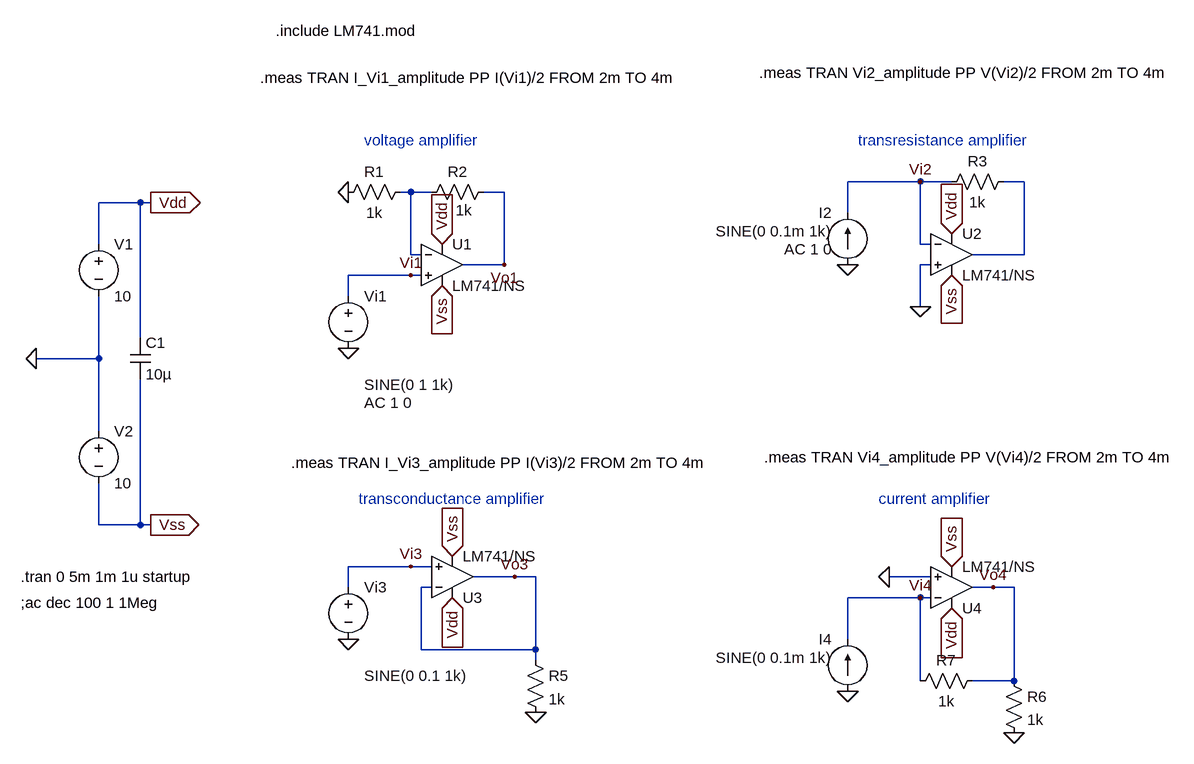
[diagram p0: schematic amplifiers_input_impedances.asc]
amplifiers_input_impedances.asc, the LTspice schematic file:
Version 4
SHEET 1 1220 680
WIRE 768 -384 656 -384
WIRE 816 -384 768 -384
WIRE 928 -384 896 -384
WIRE -16 -368 -32 -368
WIRE 16 -368 -16 -368
WIRE 128 -368 96 -368
WIRE -432 -352 -496 -352
WIRE -416 -352 -432 -352
WIRE 656 -336 656 -384
WIRE -496 -288 -496 -352
WIRE 768 -288 768 -384
WIRE 784 -288 768 -288
WIRE -16 -272 -16 -368
WIRE 0 -272 -16 -272
WIRE 928 -272 928 -384
WIRE 928 -272 848 -272
WIRE 128 -256 128 -368
WIRE 128 -256 64 -256
WIRE 784 -256 768 -256
WIRE -16 -240 -112 -240
WIRE 0 -240 -16 -240
WIRE -112 -208 -112 -240
WIRE 768 -192 768 -256
WIRE -432 -144 -432 -352
WIRE -496 -112 -496 -208
WIRE -496 -112 -592 -112
WIRE -496 0 -496 -112
WIRE -496 144 -496 80
WIRE -432 144 -432 -80
WIRE -432 144 -496 144
WIRE -416 144 -432 144
WIRE -16 208 -112 208
WIRE 16 208 -16 208
WIRE 144 224 80 224
WIRE 176 224 144 224
WIRE 784 224 720 224
WIRE -112 240 -112 208
WIRE 16 240 0 240
WIRE 880 240 848 240
WIRE 912 240 880 240
WIRE 768 256 656 256
WIRE 784 256 768 256
WIRE 656 320 656 256
WIRE 0 336 0 240
WIRE 176 336 176 224
WIRE 176 336 0 336
WIRE 176 352 176 336
WIRE 768 384 768 256
WIRE 912 384 912 240
WIRE 912 384 848 384
FLAG -416 -352 Vdd
IOPIN -416 -352 Out
FLAG -416 144 Vss
IOPIN -416 144 Out
FLAG -592 -112 0
FLAG 32 -288 Vdd
IOPIN 32 -288 In
FLAG 816 -304 Vdd
IOPIN 816 -304 In
FLAG 48 256 Vdd
IOPIN 48 256 In
FLAG 816 272 Vdd
IOPIN 816 272 In
FLAG 32 -224 Vss
IOPIN 32 -224 In
FLAG 48 192 Vss
IOPIN 48 192 In
FLAG 816 208 Vss
IOPIN 816 208 In
FLAG 816 -240 Vss
IOPIN 816 -240 In
FLAG -112 -128 0
FLAG -112 -368 0
FLAG 128 -256 Vo1
FLAG -112 320 0
FLAG 176 432 0
FLAG 656 -256 0
FLAG 768 -192 0
FLAG 720 224 0
FLAG 656 400 0
FLAG 912 464 0
FLAG 880 240 Vo4
FLAG 144 224 Vo3
FLAG -16 -240 Vi1
FLAG 768 -384 Vi2
FLAG 768 256 Vi4
FLAG -16 208 Vi3
SYMBOL voltage -496 -304 R0
WINDOW 123 0 0 Left 0
WINDOW 39 0 0 Left 0
SYMATTR InstName V1
SYMATTR Value 10
SYMBOL voltage -496 -16 R0
WINDOW 123 0 0 Left 0
WINDOW 39 0 0 Left 0
SYMATTR InstName V2
SYMATTR Value 10
SYMBOL voltage -112 -224 R0
WINDOW 123 24 180 Left 2
WINDOW 39 0 0 Left 0
WINDOW 3 24 152 Left 2
SYMATTR Value2 AC 1 0
SYMATTR Value SINE(0 1 1k)
SYMATTR InstName Vi1
SYMBOL res -16 -384 R90
WINDOW 0 0 56 VBottom 2
WINDOW 3 32 56 VTop 2
SYMATTR InstName R1
SYMATTR Value 1k
SYMBOL res 112 -384 R90
WINDOW 0 0 56 VBottom 2
WINDOW 3 28 46 VTop 2
SYMATTR InstName R2
SYMATTR Value 1k
SYMBOL res 160 336 R0
SYMATTR InstName R5
SYMATTR Value 1k
SYMBOL res 912 -400 R90
WINDOW 0 0 56 VBottom 2
WINDOW 3 32 56 VTop 2
SYMATTR InstName R3
SYMATTR Value 1k
SYMBOL current 656 -256 R180
WINDOW 0 24 80 Left 2
WINDOW 3 24 52 Left 2
WINDOW 123 24 24 Left 2
WINDOW 39 0 0 Left 0
SYMATTR InstName I2
SYMATTR Value SINE(0 0.1m 1k)
SYMATTR Value2 AC 1 0
SYMBOL res 896 368 R0
SYMATTR InstName R6
SYMATTR Value 1k
SYMBOL res 864 368 R90
WINDOW 0 0 56 VBottom 2
WINDOW 3 32 56 VTop 2
SYMATTR InstName R7
SYMATTR Value 1k
SYMBOL OpAmps\\opamp2 816 -336 R0
SYMATTR InstName U2
SYMATTR Value LM741/NS
SYMBOL OpAmps\\opamp2 32 -320 R0
SYMATTR InstName U1
SYMATTR Value LM741/NS
SYMBOL OpAmps\\opamp2 48 288 M180
SYMATTR InstName U3
SYMATTR Value LM741/NS
SYMBOL OpAmps\\opamp2 816 304 M180
SYMATTR InstName U4
SYMATTR Value LM741/NS
SYMBOL voltage -112 224 R0
WINDOW 123 24 124 Left 2
WINDOW 39 0 0 Left 0
WINDOW 3 24 152 Left 2
SYMATTR Value SINE(0 0.1 1k)
SYMATTR InstName Vi3
SYMBOL current 656 400 R180
WINDOW 0 24 80 Left 2
WINDOW 3 24 52 Left 2
WINDOW 123 24 -28 Left 2
WINDOW 39 0 0 Left 0
SYMATTR InstName I4
SYMATTR Value SINE(0 0.1m 1k)
SYMBOL cap -448 -144 R0
SYMATTR InstName C1
SYMATTR Value 10µ
TEXT -88 -448 Left 2 ;voltage amplifier
TEXT 704 104 Left 2 ;current amplifier
TEXT -96 104 Left 2 ;transconductance amplifier
TEXT 672 -448 Left 2 ;transresistance amplifier
TEXT -616 224 Left 2 !.tran 0 5m 1m 1u startup
TEXT -224 -616 Left 2 !.include LM741.mod
TEXT -248 -544 Left 2 !.meas TRAN I_Vi1_amplitude PP I(Vi1)/2 FROM 2m TO 4m
TEXT 520 -552 Left 2 !.meas TRAN Vi2_amplitude PP V(Vi2)/2 FROM 2m TO 4m
TEXT -200 48 Left 2 !.meas TRAN I_Vi3_amplitude PP I(Vi3)/2 FROM 2m TO 4m
TEXT 528 40 Left 2 !.meas TRAN Vi4_amplitude PP V(Vi4)/2 FROM 2m TO 4m
TEXT -616 264 Left 2 !;ac dec 100 1 1Meg

The netlist it stands for:
* amplifiers_input_impedances.asc
V1 Vdd 0 10
V2 0 Vss 10
Vi1 Vi1 0 SINE(0 1 1k) AC 1 0
R1 N002 0 1k
R2 Vo1 N002 1k
R5 Vo3 0 1k
R3 N001 Vi2 1k
I2 0 Vi2 SINE(0 0.1m 1k) AC 1 0
R6 Vo4 0 1k
R7 Vo4 Vi4 1k
XU2 0 Vi2 Vdd Vss N001 LM741/NS  ; pins In+ In- V+ V- OUT
XU1 Vi1 N002 Vdd Vss Vo1 LM741/NS  ; pins In+ In- V+ V- OUT
XU3 Vi3 Vo3 Vdd Vss Vo3 LM741/NS  ; pins In+ In- V+ V- OUT
XU4 0 Vi4 Vdd Vss Vo4 LM741/NS  ; pins In+ In- V+ V- OUT
Vi3 Vi3 0 SINE(0 0.1 1k)
I4 0 Vi4 SINE(0 0.1m 1k)
C1 Vdd Vss 10µ
* voltage amplifier
* current amplifier
* transconductance amplifier
* transresistance amplifier
.tran 0 5m 1m 1u startup
.include LM741.mod
.meas TRAN I_Vi1_amplitude PP I(Vi1)/2 FROM 2m TO 4m
.meas TRAN Vi2_amplitude PP V(Vi2)/2 FROM 2m TO 4m
.meas TRAN I_Vi3_amplitude PP I(Vi3)/2 FROM 2m TO 4m
.meas TRAN Vi4_amplitude PP V(Vi4)/2 FROM 2m TO 4m
;ac dec 100 1 1Meg
.backanno
.end